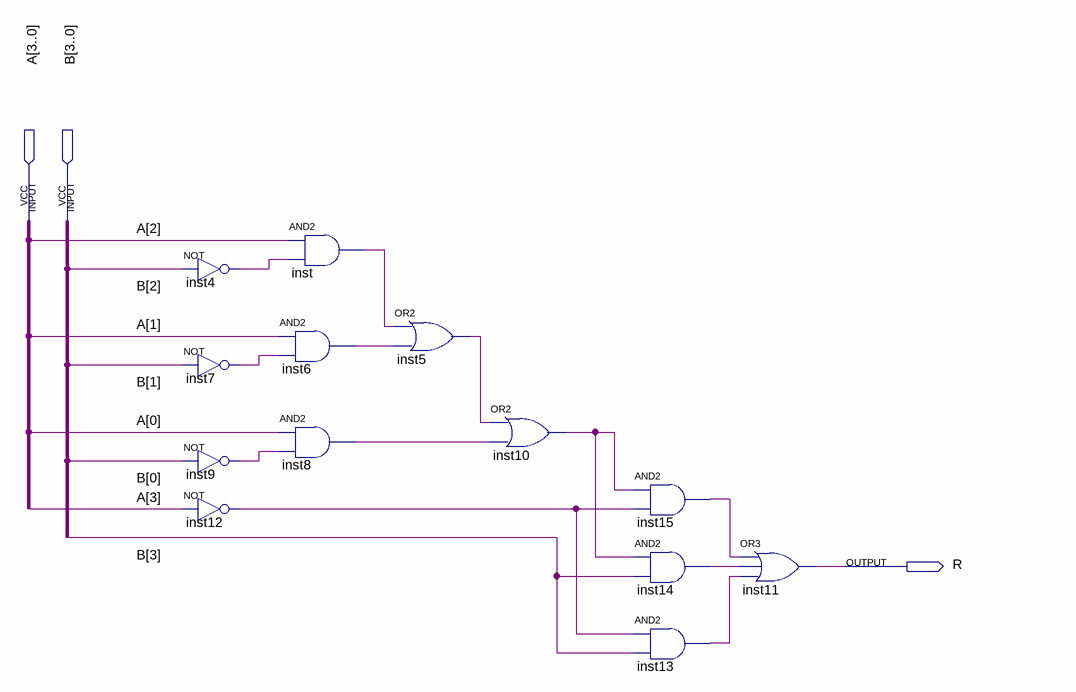
[diagram p0: schematic sheet]
// Quartus schematic maiorQueDiferenciado.bdf as structural Verilog: 13 symbols, 3 pins
module maiorQueDiferenciado (
  input  [3:0] A,
  input  [3:0] B,
  output R
);

  wire inst4_out, inst5_out, inst6_out, inst7_out, inst8_out, inst9_out, inst10_out, inst12_out, inst13_out,
       inst14_out, inst15_out, inst_out;

  not inst4 (inst4_out, B[2]);
  not inst7 (inst7_out, B[1]);
  not inst9 (inst9_out, B[0]);
  not inst12 (inst12_out, A[3]);
  and inst (inst_out, A[2], inst4_out);
  and inst6 (inst6_out, A[1], inst7_out);
  and inst8 (inst8_out, A[0], inst9_out);
  or inst5 (inst5_out, inst_out, inst6_out);
  or inst10 (inst10_out, inst5_out, inst8_out);
  and inst15 (inst15_out, inst10_out, inst12_out);
  and inst14 (inst14_out, inst10_out, B[3]);
  and inst13 (inst13_out, inst12_out, B[3]);
  or inst11 (R, inst15_out, inst14_out, inst13_out);
endmodule
